# Altium schematic sheet connectivity.SchDoc
size A4
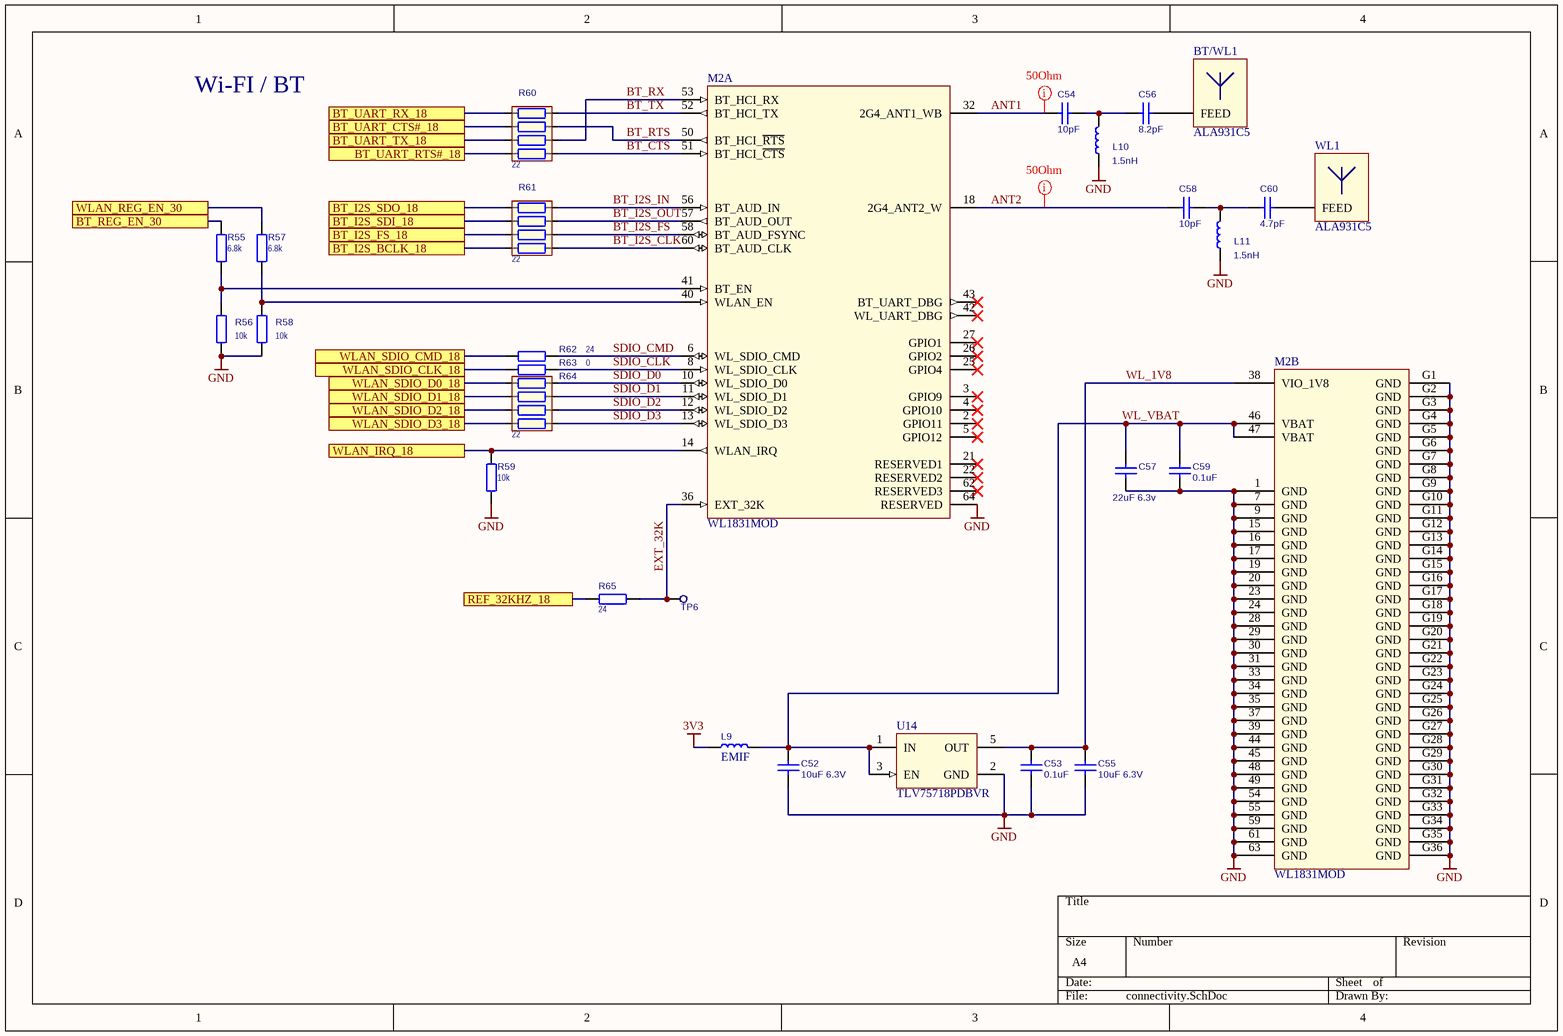
[diagram p0: connectivity.SchDoc]

## Parts
BT/WL1  ALA931C5  [9x3x1.2]
C52  value 10uF 6.3V  [C0603]  (hidden comment: CC0603MRX5R5BB106)
C53  value 0.1uF  [C0603]  (hidden comment: C1608X7R1H104K080AA)
C54  value 10pF  [C0603]  (hidden comment: CL10C100JB8NNNC)
C55  value 10uF 6.3V  [C0603]  (hidden comment: CC0603MRX5R5BB106)
C56  value 8.2pF  [C0603]  (hidden comment: CL10C8R2CB8NNNC)
C57  value 22uF 6.3v  [C0805]  (hidden comment: CL21A226MQQNNNE)
C58  value 10pF  [C0603]  (hidden comment: CL10C100JB8NNNC)
C59  value 0.1uF  [C0603]  (hidden comment: C1608X7R1H104K080AA)
C60  value 4.7pF  [C0603]  (hidden comment: CC0603CRNPO9BN4R7)
L9  value EMIF  [IND0805]  (hidden comment: BLM21PG221SN1D)
L10  1.5nH  [IND0603]
L11  1.5nH  [IND0603]
M2  WL1831MOD  [E-13.4X13.3-N100_0.75-TOP]  (parts A,B of 2)
R55  6.8k  [R0603]
R56  10k  [R0603]
R57  6.8k  [R0603]
R58  10k  [R0603]
R59  10k  [R0603]
R60  value 22  [R0804X4]  (hidden comment: TC124-JR-0722RL)
R61  value 22  [R0804X4]  (hidden comment: TC124-JR-0722RL)
R62  value 24  [R0603]  (hidden comment: 22)
R63  0  [R0603]
R64  value 22  [R0804X4]  (hidden comment: TC124-JR-0722RL)
R65  value 24  [R0603]  (hidden comment: 22)
TP6  TEST-POINT  [PAD]  (value not drawn)
U14  TLV75718PDBVR  [SOT-23-5]
WL1  ALA931C5  [9x3x1.2]

## Ports
BT_I2S_BCLK_18, BT_I2S_FS_18, BT_I2S_SDI_18, BT_I2S_SDO_18, BT_REG_EN_30, BT_UART_CTS#_18, BT_UART_RTS#_18, BT_UART_RX_18, BT_UART_TX_18, REF_32KHZ_18, WLAN_IRQ_18, WLAN_REG_EN_30, WLAN_SDIO_CLK_18, WLAN_SDIO_CMD_18, WLAN_SDIO_D0_18, WLAN_SDIO_D1_18, WLAN_SDIO_D2_18, WLAN_SDIO_D3_18

## Nets
3V3: L9.2
GND: C52.2 C53.2 C55.2 C57.1 C59.1 L10.1 L11.1 M2.1(GND) M2.7(GND) M2.9(GND) M2.15(GND) M2.16(GND) M2.17(GND) M2.19(GND) M2.20(GND) M2.23(GND) M2.24(GND) M2.28(GND) M2.29(GND) M2.30(GND) M2.31(GND) M2.33(GND) M2.34(GND) M2.35(GND) M2.37(GND) M2.39(GND) M2.44(GND) M2.45(GND) M2.48(GND) M2.49(GND) M2.54(GND) M2.55(GND) M2.59(GND) M2.61(GND) M2.63(GND) M2.64(RESERVED) M2.G1(GND) M2.G2(GND) M2.G3(GND) M2.G4(GND) M2.G5(GND) M2.G6(GND) M2.G7(GND) M2.G8(GND) M2.G9(GND) M2.G10(GND) M2.G11(GND) M2.G12(GND) M2.G13(GND) M2.G14(GND) M2.G15(GND) M2.G16(GND) M2.G17(GND) M2.G18(GND) M2.G19(GND) M2.G20(GND) M2.G21(GND) M2.G22(GND) M2.G23(GND) M2.G24(GND) M2.G25(GND) M2.G26(GND) M2.G27(GND) M2.G28(GND) M2.G29(GND) M2.G30(GND) M2.G31(GND) M2.G32(GND) M2.G33(GND) M2.G34(GND) M2.G35(GND) M2.G36(GND) R56.2 R58.1 R59.1 U14.2(GND)
ANT1: C54.1 M2.32(2G4_ANT1_WB)
ANT2: C58.1 M2.18(2G4_ANT2_W)
BT_CTS: M2.51(BT_HCI_~{CTS}) R60.8
BT_I2S_BCLK_18: R61.7 ; port BT_I2S_BCLK_18
BT_I2S_CLK: M2.60(BT_AUD_CLK) R61.8
BT_I2S_FS: M2.58(BT_AUD_FSYNC) R61.6
BT_I2S_FS_18: R61.5 ; port BT_I2S_FS_18
BT_I2S_IN: M2.56(BT_AUD_IN) R61.2
BT_I2S_OUT: M2.57(BT_AUD_OUT) R61.4
BT_I2S_SDI_18: R61.3 ; port BT_I2S_SDI_18
BT_I2S_SDO_18: R61.1 ; port BT_I2S_SDO_18
BT_REG_EN_30: R55.1 ; port BT_REG_EN_30
BT_RTS: M2.50(BT_HCI_~{RTS}) R60.4
BT_RX: M2.53(BT_HCI_RX) R60.6
BT_TX: M2.52(BT_HCI_TX) R60.2
BT_UART_CTS#_18: R60.3 ; port BT_UART_CTS#_18
BT_UART_RTS#_18: R60.7 ; port BT_UART_RTS#_18
BT_UART_RX_18: R60.1 ; port BT_UART_RX_18
BT_UART_TX_18: R60.5 ; port BT_UART_TX_18
EXT_32K: M2.36(EXT_32K) R65.2 TP6.1
REF_32KHZ_18: R65.1 ; port REF_32KHZ_18
SDIO_CLK: M2.8(WL_SDIO_CLK) R63.1
SDIO_CMD: M2.6(WL_SDIO_CMD) R62.1
SDIO_D0: M2.10(WL_SDIO_D0) R64.1
SDIO_D1: M2.11(WL_SDIO_D1) R64.3
SDIO_D2: M2.12(WL_SDIO_D2) R64.5
SDIO_D3: M2.13(WL_SDIO_D3) R64.7
WL_1V8: C53.1 C55.1 M2.38(VIO_1V8) U14.5(OUT)
WL_VBAT: C52.1 C57.2 C59.2 L9.1 M2.46(VBAT) M2.47(VBAT) U14.1(IN) U14.3(EN)
WLAN_IRQ_18: M2.14(WLAN_IRQ) R59.2 ; port WLAN_IRQ_18
WLAN_REG_EN_30: R57.1 ; port WLAN_REG_EN_30
WLAN_SDIO_CLK_18: R63.2 ; port WLAN_SDIO_CLK_18
WLAN_SDIO_CMD_18: R62.2 ; port WLAN_SDIO_CMD_18
WLAN_SDIO_D0_18: R64.2 ; port WLAN_SDIO_D0_18
WLAN_SDIO_D1_18: R64.4 ; port WLAN_SDIO_D1_18
WLAN_SDIO_D2_18: R64.6 ; port WLAN_SDIO_D2_18
WLAN_SDIO_D3_18: R64.8 ; port WLAN_SDIO_D3_18
NetBT/WL1_1: BT/WL1.1(FEED) C56.2
NetC54_2: C54.2 C56.1 L10.2
NetC58_2: C58.2 C60.1 L11.2
NetC60_2: C60.2 WL1.1(FEED)
NetM2_40: M2.40(WLAN_EN) R57.2 R58.2
NetM2_41: M2.41(BT_EN) R55.2 R56.1

Not connected (* = marked no-connect by the designer): M2 2(GPIO11)* 3(GPIO9)* 4(GPIO10)* 5(GPIO12)* 21(RESERVED1)* 22(RESERVED2)* 25(GPIO4)* 26(GPIO2)* 27(GPIO1)* 42(WL_UART_DBG)* 43(BT_UART_DBG)* 62(RESERVED3)*

## Layout directives
rule Undefined: ANT1, ANT2

## Notes on the sheet
- Wi-FI / BT

## Library data of the parts
BT/WL1 WL1 = CHIP-ANT: Ceramic chip antenna; value: ALA931C5
C52-C60 = CAP_NPOL
L9 = IND_WO_IRON
L10 L11 = IND_WO_IRON: Value: CLH1608T-1N5S-S
M2 = WL18xxMOD
R55-R59 R62 R63 R65 = RESISTOR: RES
  R55 R57: Value: 6.8k
  R56 R58 R59: Value: 10k
  R63: Value: 0
R60 R61 R64 = ARRAY
TP6 = TEST-POINT: PCB terminal block; Value: *
U14 = TLV733P: Capacitor-Free, 300-mA, Low-Dropout Regulator with Foldback Current Limit for Portable Devices; value: TLV733P